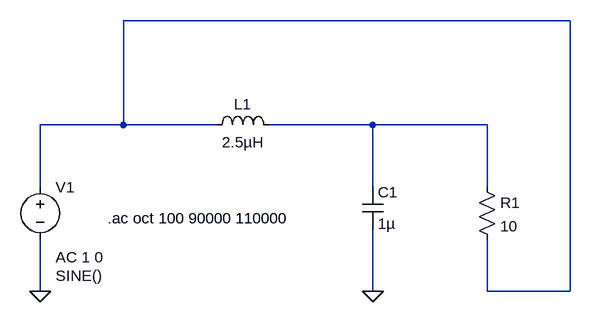
[diagram p0: schematic loaded_resonanse_serial.asc]
loaded_resonanse_serial.asc, the LTspice schematic file:
Version 4
SHEET 1 948 680
WIRE 944 -288 256 -288
WIRE 256 -128 256 -288
WIRE 256 -128 128 -128
WIRE 400 -128 256 -128
WIRE 640 -128 480 -128
WIRE 816 -128 640 -128
WIRE 128 -32 128 -128
WIRE 640 -32 640 -128
WIRE 816 -32 816 -128
WIRE 128 128 128 48
WIRE 640 128 640 32
WIRE 816 128 816 48
WIRE 944 128 944 -288
WIRE 944 128 816 128
FLAG 128 128 0
FLAG 640 128 0
SYMBOL cap 624 -32 R0
SYMATTR InstName C1
SYMATTR Value 1µ
SYMBOL ind 384 -112 R270
WINDOW 0 32 56 VTop 2
WINDOW 3 5 56 VBottom 2
SYMATTR InstName L1
SYMATTR Value 2.5µH
SYMBOL res 800 -48 R0
SYMATTR InstName R1
SYMATTR Value 10
SYMBOL voltage 128 -48 R0
WINDOW 3 24 152 Left 2
WINDOW 123 24 124 Left 2
WINDOW 39 0 0 Left 0
SYMATTR Value SINE()
SYMATTR Value2 AC 1 0
SYMATTR InstName V1
TEXT 232 16 Left 2 !.ac oct 100 90000 110000

The netlist it stands for:
* loaded_resonanse_serial.asc
C1 N002 0 1µ
L1 N001 N002 2.5µH
R1 N002 N001 10
V1 N001 0 SINE() AC 1 0
.ac oct 100 90000 110000
.backanno
.end